# EAGLE design playpad_shield (EAGLE 5.10)

## Sheet 1 of 2
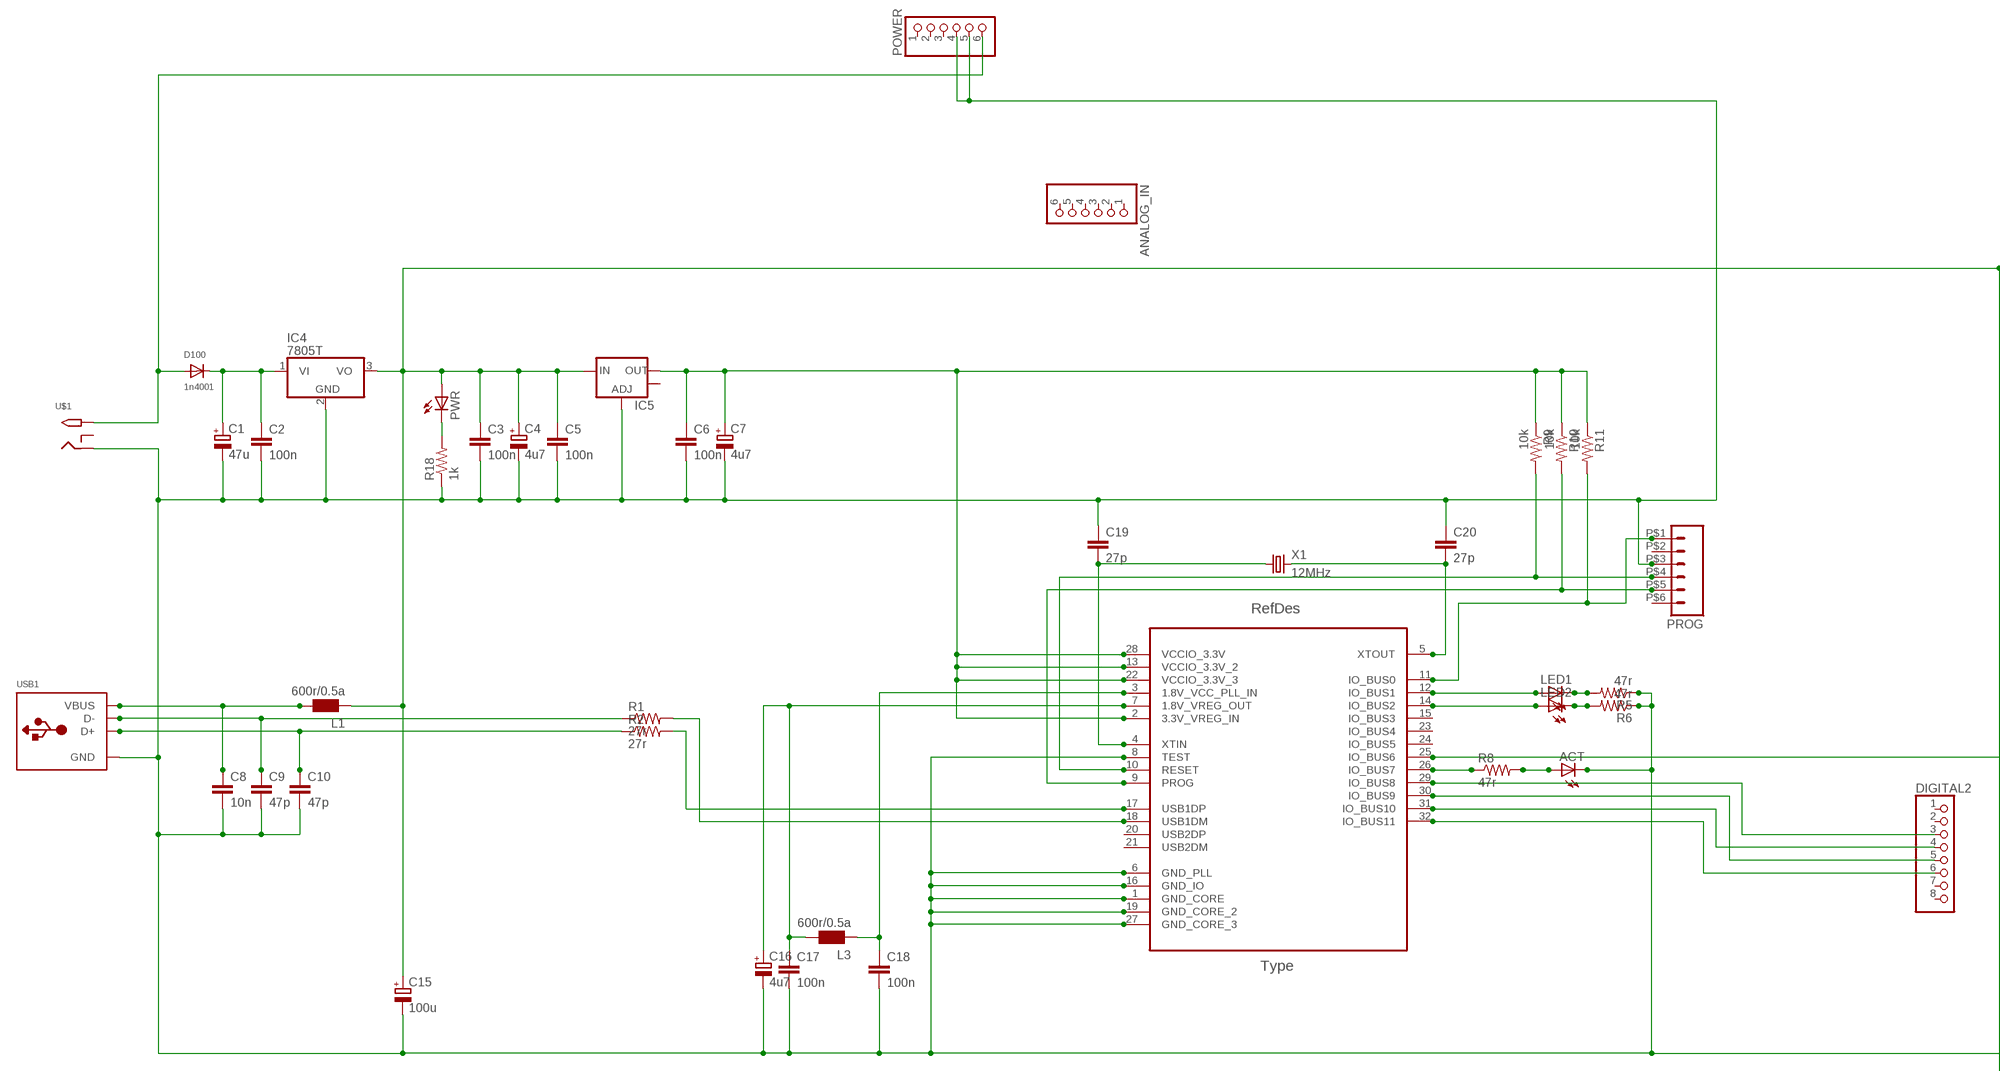
[diagram p0: schematic, sheet 1, part 1 of 2]
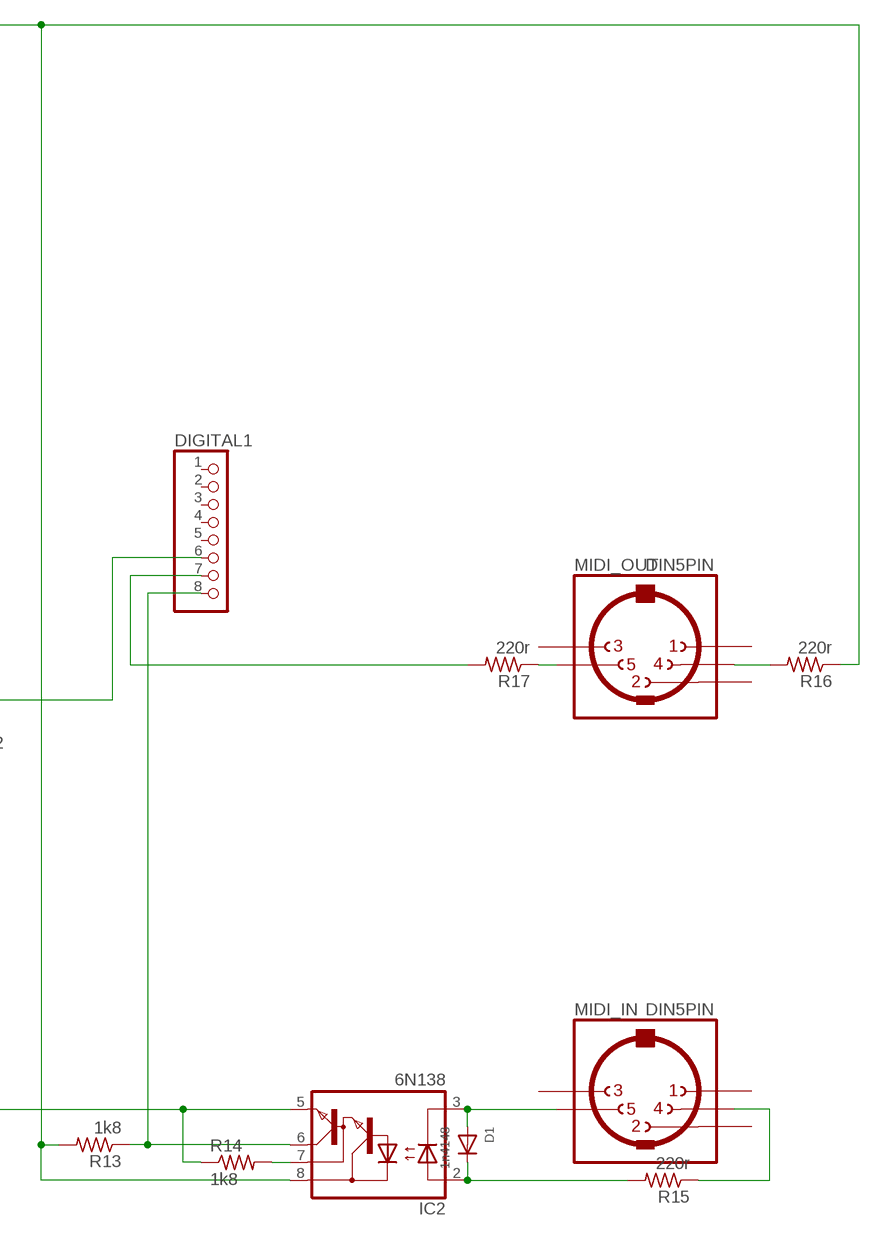
[diagram p1: schematic, sheet 1, part 2 of 2]

### Parts
ACT  LEDCHIP-LED0805  [CHIP-LED0805]
ANALOG_IN  PINHD-1X6  [1X06]
C1  47u  CPOL-EUA/3216-18W  [A/3216-18W]
C2  100n  C-EUC0805  [C0805]
C3  100n  C-EUC0805  [C0805]
C4  4u7  CPOL-EUA/3216-18W  [A/3216-18W]
C5  100n  C-EUC0805  [C0805]
C6  100n  C-EUC0805  [C0805]
C7  4u7  CPOL-EUA/3216-18W  [A/3216-18W]
C8  10n  C-EUC0805  [C0805]
C9  47p  C-EUC0805  [C0805]
C10  47p  C-EUC0805  [C0805]
C15  100u  CPOL-EUD/7343-31R  [D/7343-31R]
C16  4u7  CPOL-EUA/3216-18W  [A/3216-18W]
C17  100n  C-EUC0805  [C0805]
C18  100n  C-EUC0805  [C0805]
C19  27p  C-EUC0805  [C0805]
C20  27p  C-EUC0805  [C0805]
D1  1n4148  DIODESOD-123  [SOD-123]
D100  1n4001  DIODESOD-123  [SOD-123]
DIGITAL1  PINHD-1X8  [1X08]
DIGITAL2  PINHD-1X8  [1X08]
IC1  VNC2-32L1B  [QFP80P900X900X160-33N]
IC2  6N138  [DIL08]
IC4  7805T  [TO220H]
IC5  V_REG_LM1117SOT223  [SOT223]
L1  600r/0.5a  WE-CBF_0805  [0805]
L3  600r/0.5a  WE-CBF_0805  [0805]
LED1  LEDCHIP-LED0805  [CHIP-LED0805]
LED2  LEDCHIP-LED0805  [CHIP-LED0805]
MIDI_IN  DIN5PIN  [CHEAPYDIN]
MIDI_OUT  DIN5PIN  [CHEAPYDIN]
POWER  PINHD-1X6  [1X06]
PROG  M06  [MA062MM]
PWR  LEDCHIP-LED0805  [CHIP-LED0805]
R1  27r  R-US_R0805  [R0805]
R2  27r  R-US_R0805  [R0805]
R5  47r  R-US_R0805  [R0805]
R6  47r  R-US_R0805  [R0805]
R8  47r  R-US_R0805  [R0805]
R9  10k  R-US_R0805  [R0805]
R10  10k  R-US_R0805  [R0805]
R11  10k  R-US_R0805  [R0805]
R13  1k8  R-US_R0805  [R0805]
R14  1k8  R-US_R0805  [R0805]
R15  220r  R-US_R0805  [R0805]
R16  220r  R-US_R0805  [R0805]
R17  220r  R-US_R0805  [R0805]
R18  1k  R-US_R0805  [R0805]
U$1  2.1MMJACKTHM  [PJ-102A]
USB1  USB_TYPEAPTHFML  [USB_HOST-PTH]
X1  12MHz  CRYSTALHC49S  [HC49/S]

### Nets
3V3: C6.1 C7.+ IC1.2(3.3V_VREG_IN) IC1.13(VCCIO_3.3V_2) IC1.22(VCCIO_3.3V_3) IC1.28(VCCIO_3.3V) IC5.2(OUT) R9.1 R10.1 R11.1
5V: C3.1 C4.+ C5.1 C15.+ IC2.8(VCC) IC4.3(VO) IC5.3(IN) L1.1 PWR.A R13.2 R16.1
GND: ACT.C C1.- C2.2 C3.2 C4.- C5.2 C6.2 C7.- C8.2 C9.2 C10.2 C15.- C16.- C17.2 C18.2 C19.1 C20.1 IC1.1(GND_CORE) IC1.6(GND_PLL) IC1.8(TEST) IC1.16(GND_IO) IC1.19(GND_CORE_2) IC1.27(GND_CORE_3) IC2.5(GND) IC4.2(GND) IC5.1(ADJ) POWER.4 POWER.5 PROG.P$3 R5.1 R6.1 R14.1 R18.1 U$1.RING USB1.GND
MIDI_RX: DIGITAL1.8 IC2.6(VO) R13.1
MIDI_TX: DIGITAL1.7 R17.2
N$1: C18.1 IC1.3(1.8V_VCC_PLL_IN) L3.1
N$2: IC1.12(IO_BUS1) LED1.A
N$3: PWR.C R18.2
N$4: IC1.14(IO_BUS2) LED2.A
N$7: C1.+ C2.1 D100.C IC4.1(VI)
N$8: C8.1 L1.2 USB1.VBUS
N$9: LED1.C R5.2
N$10: LED2.C R6.2
N$14: C10.1 R2.1 USB1.D+
N$15: C9.1 R1.1 USB1.D-
N$17: IC1.26(IO_BUS7) R8.1
N$22: IC1.11(IO_BUS0) PROG.P$1 R11.2
N$23: MIDI_OUT.5 R17.1
N$26: D1.A IC2.3(C) MIDI_IN.5
N$31: ACT.A R8.2
N$33: D1.C IC2.2(A) R15.2
N$34: MIDI_IN.4 R15.1
N$36: IC2.7(VB) R14.2
N$42: C16.+ C17.1 IC1.7(1.8V_VREG_OUT) L3.2
N$55: MIDI_OUT.4 R16.2
PROG: IC1.9(PROG) PROG.P$5 R10.2
RESET: IC1.10(RESET) PROG.P$4 R9.2
SLAVE_INT: DIGITAL1.6 IC1.25(IO_BUS6)
SPI_SLAVE_CLK: DIGITAL2.3 IC1.29(IO_BUS8)
SPI_SLAVE_MISO: DIGITAL2.4 IC1.31(IO_BUS10)
SPI_SLAVE_MOSI: DIGITAL2.5 IC1.30(IO_BUS9)
SPI_SLAVE_SS: DIGITAL2.6 IC1.32(IO_BUS11)
USB1DM: IC1.18(USB1DM) R1.2
USB1DP: IC1.17(USB1DP) R2.2
VIN: D100.A POWER.6 U$1.TIP
XTIN: C19.2 IC1.4(XTIN) X1.1
XTOUT: C20.2 IC1.5(XTOUT) X1.2
Unconnected: ANALOG_IN.1 ANALOG_IN.2 ANALOG_IN.3 ANALOG_IN.4 ANALOG_IN.5 ANALOG_IN.6 DIGITAL1.1 DIGITAL1.2 DIGITAL1.3 DIGITAL1.4 DIGITAL1.5 DIGITAL2.1 DIGITAL2.2 DIGITAL2.7 DIGITAL2.8 IC1.15(IO_BUS3) IC1.20(USB2DP) IC1.21(USB2DM) IC1.23(IO_BUS4) IC1.24(IO_BUS5) IC5.4(OUT) MIDI_IN.1 MIDI_IN.2 MIDI_IN.3 MIDI_OUT.1 MIDI_OUT.2 MIDI_OUT.3 POWER.1 POWER.2 POWER.3 PROG.P$2 PROG.P$6 U$1.RING_SW

## Sheet 2 of 2
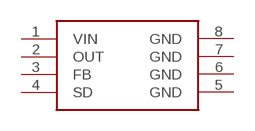
[diagram p2: schematic, sheet 2]

### Parts
U$2  AP1509_SW_REG  [SO08]
Unconnected: U$2.1(VIN) U$2.2(OUT) U$2.3(FB) U$2.4(SD)

## Power pins joined to a net without a drawn wire
GND: U$2.5(GND) U$2.6(GND) U$2.7(GND) U$2.8(GND)

## Library data of the parts
ACT LED1 LED2 PWR = led:LED: LED OSRAM: - CHIPLED LG R971, LG N971, LY N971, LG Q971, LY Q971, LO R971, LY R971 LH N974, LH R974 LS Q976, LO Q976, LY Q976 LO Q996 - Hyper CHIPLED LW Q18S LB Q993, LB Q99A, LB R99A - SideLED LS A670, LO A670, LY A670, LG A670, LP A670 LB A673, LV A673, LT A673, LW A673 LH A674 LY A675 LS A676, LA A676, LO A676, LY A676, LW A676 LS A679, LY A679, LG A679 - Hyper Micro SIDELED® LS Y876, LA Y876, LO Y876, LY Y876 LT Y87S - SmartLED LW L88C, LW L88S LB L89C, LB L89S, LG L890 LS L89K, LO L89K, LY L89K LS L896, LA L896, LO L896, LY L896 - TOPLED LS T670, LO T670, LY T670, LG T670, LP T670 LSG T670, LSP T670, LSY T670, LOP T670, LYG T670 LG T671, LOG T671, LSG T671 LB T673, LV T673, LT T673, LW T673 LH T674 LS T676, LA T676, LO T676, LY T676, LB T676, LH T676, LSB T676, LW T676 LB T67C, LV T67C, LT T67C, LS T67K, LO T67K, LY T67K, LW E67C LS E67B, LA E67B, LO E67B, LY E67B, LB E67C, LV E67C, LT E67C LW T67C LS T679, LY T679, LG T679 LS T770, LO T770, LY T770, LG T770, LP T770 LB T773, LV T773, LT T773, LW T773 LH T774 LS E675, LA E675, LY E675, LS T675 LS T776, LA T776, LO T776, LY T776, LB T776 LHGB T686 LT T68C, LB T68C - Hyper Mini TOPLED® LB M676 - Mini TOPLED Santana® LG M470 LS M47K, LO M47K, LY M47K Source: http://www.osram.convergy.de LUXEON: - LUMILED® LXK2-PW12-R00, LXK2-PW12-S00, LXK2-PW14-U00, LXK2-PW14-V00 LXK2-PM12-R00, LXK2-PM12-S00, LXK2-PM14-U00 LXK2-PE12-Q00, LXK2-PE12-R00, LXK2-PE12-S00, LXK2-PE14-T00, LXK2-PE14-U00 LXK2-PB12-K00, LXK2-PB12-L00, LXK2-PB12-M00, LXK2-PB14-N00, LXK2-PB14-P00, LXK2-PB14-Q00 LXK2-PR12-L00, LXK2-PR12-M00, LXK2-PR14-Q00, LXK2-PR14-R00 LXK2-PD12-Q00, LXK2-PD12-R00, LXK2-PD12-S00 LXK2-PH12-R00, LXK2-PH12-S00 LXK2-PL12-P00, LXK2-PL12-Q00, LXK2-PL12-R00 Source: www.luxeon.com KINGBRIGHT: KA-3528ASYC Source: www.kingbright.com
ANALOG_IN POWER = pinhead:PINHD-1X6: PIN HEADER
C1 C4 C7 C15 C16 = rcl:CPOL-EU: POLARIZED CAPACITOR, European symbol
C2 C3 C5 C6 C8-C10 C17-C20 = rcl:C-EU: CAPACITOR, European symbol
D1 D100 = adafruit:DIODE: Diode SMADIODE - SMA Surface Mount Package 20V 1A Schottky Diode Digikey: 641-1014-6-ND DO-1N4148 - Through Hole Small Current Diode SOD-123 20V 1 A (.5mV Vf) Schottky Diode - Digikey: MBRX120TPMSCT-ND SOD-323 10V 570mA (.38mV Vf, 3ns) Schottky Diode - Digikey: ZLLS410CT-ND SOD-523 30V 30mA Schottky Diode (RB751S-40TE61) - Digikey: RB751S-40TE61CT-ND SOT23-R/W - SOT23 Package (R = Solder Paste/Reflow Ovens, W = Hand-Soldering) BAT54Film 40V 300mA - Digikey: 497-7162-1-ND
DIGITAL1 DIGITAL2 = pinhead:PINHD-1X8: PIN HEADER
IC1 = farnell_downloads:VNC2-32L1B: Embedded Dual USB Host Controller; DESCRIPTION: Embedded Dual USB Host Controller; MPN: VNC2-32L1B; OC_FARNELL: 1863854; OC_NEWARK: 27T5918; PACKAGE: QFP-32; SUPPLIER: FTDI
IC2 = optocoupler:6N138: MOTOROLA OPTO COUPLER
IC4 = linear:78*: Positive VOLTAGE REGULATOR Source: http://cache.national.com/ds/LM/LM78L05.pdf http://www.fairchildsemi.com/ds/LM/LM7805.pdf
IC5 = SparkFun:V_REG_LM1117: Voltage Regulator LM1117 Standard adjustable voltage regulator but in SMD form. Spark Fun Electronics SKU : COM-00595
L1 L3 = wuerth-elektronik:WE-CBF: SMD EMI Suppression Ferrite Beads - excellent anti-EMI properties - low DCR - impedances till 3000 ohms - rated current up to 6 A
MIDI_IN MIDI_OUT = jasons_stuff:DIN5PIN: Female CONNECTOR 5 pins 90 deg. with shield, horizontal (DIN 41524)
PROG = jasons_stuff:M06: Header 6 Standard 6-pin 0.1" header. Use with straight break away headers (SKU : PRT-00116), right angle break away headers (PRT-00553), swiss pins (PRT-00743), machine pins (PRT-00117), and female headers (PRT-00115). Molex polarized connector foot print use with SKU : PRT-08094 with associated crimp pins and housings. NOTES ON THE VARIANTS LOCK and LOCK_LONGPADS... This footprint was designed to help hold the alignment of a through-hole component (i.e. 6-pin header) while soldering it into place. You may notice that each hole has been shifted either up or down by 0.005 of an inch from it's more standard position (which is a perfectly straight line). This slight alteration caused the pins (the squares in the middle) to touch the edges of the holes. Because they are alternating, it causes a "brace" to hold the component in place. 0.005 has proven to be the perfect amount of "off-center" position when using our standard breakaway headers. Although looks a little odd when you look at the bare footprint, once you have a header in there, the alteration is very hard to notice. Also, if you push a header all the way into place, it is covered up entirely on the bottom side. This idea of altering the position of holes to aid alignment will be further integrated into the Sparkfun Library for other footprints. It can help hold any component with 3 or more connection pins.
R1 R2 R5 R6 R8-R11 R13-R18 = adafruit:R-US_: RESISTOR, American symbol
U$1 = adafruit:2.1MMJACK: 2.1mm x 5.5mm THM DC jack with internal switch. Digikey part #PJ-102A, 4UCON part #05537 2.1mm x 5.5mm SMT DC jack with internal switch. Digikey part #PJ-002A-SMT, 4UCON part #03267 By microbuilder.eu & adafruit.com
U$2 = jasons_stuff:AP1509_SW_REG
USB1 = microbuilder:USB_TYPEA: USB - Type A Connectors SMT Male - 4UCON: 10017 PTH Female - ???
X1 = crystal:CRYSTAL: CRYSTAL

## Board
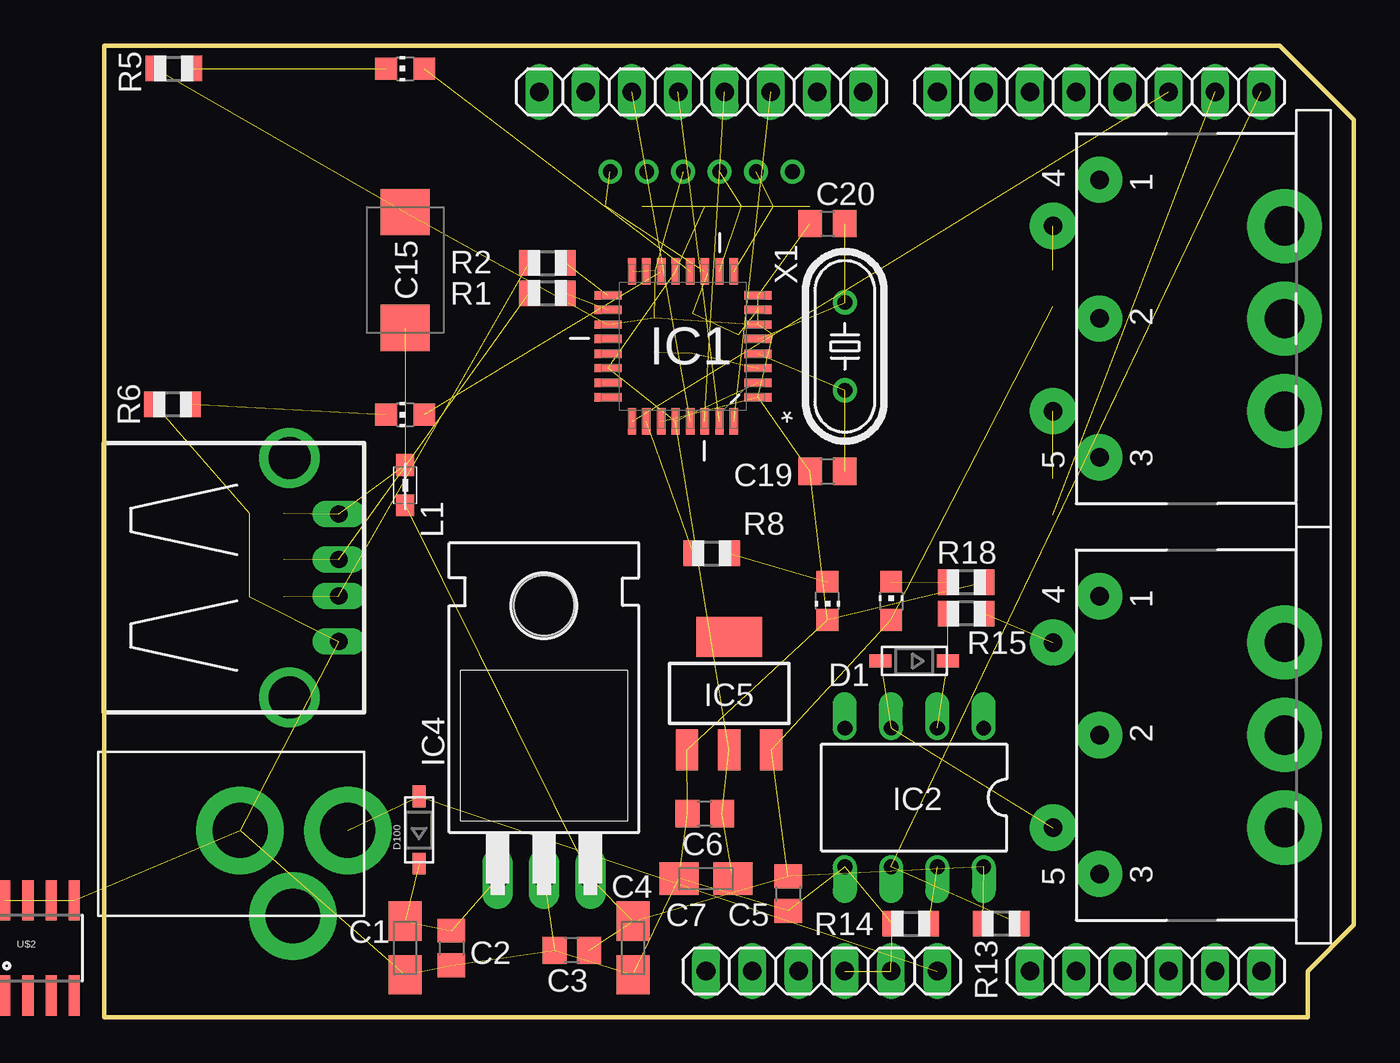
[diagram p3: board, top side]
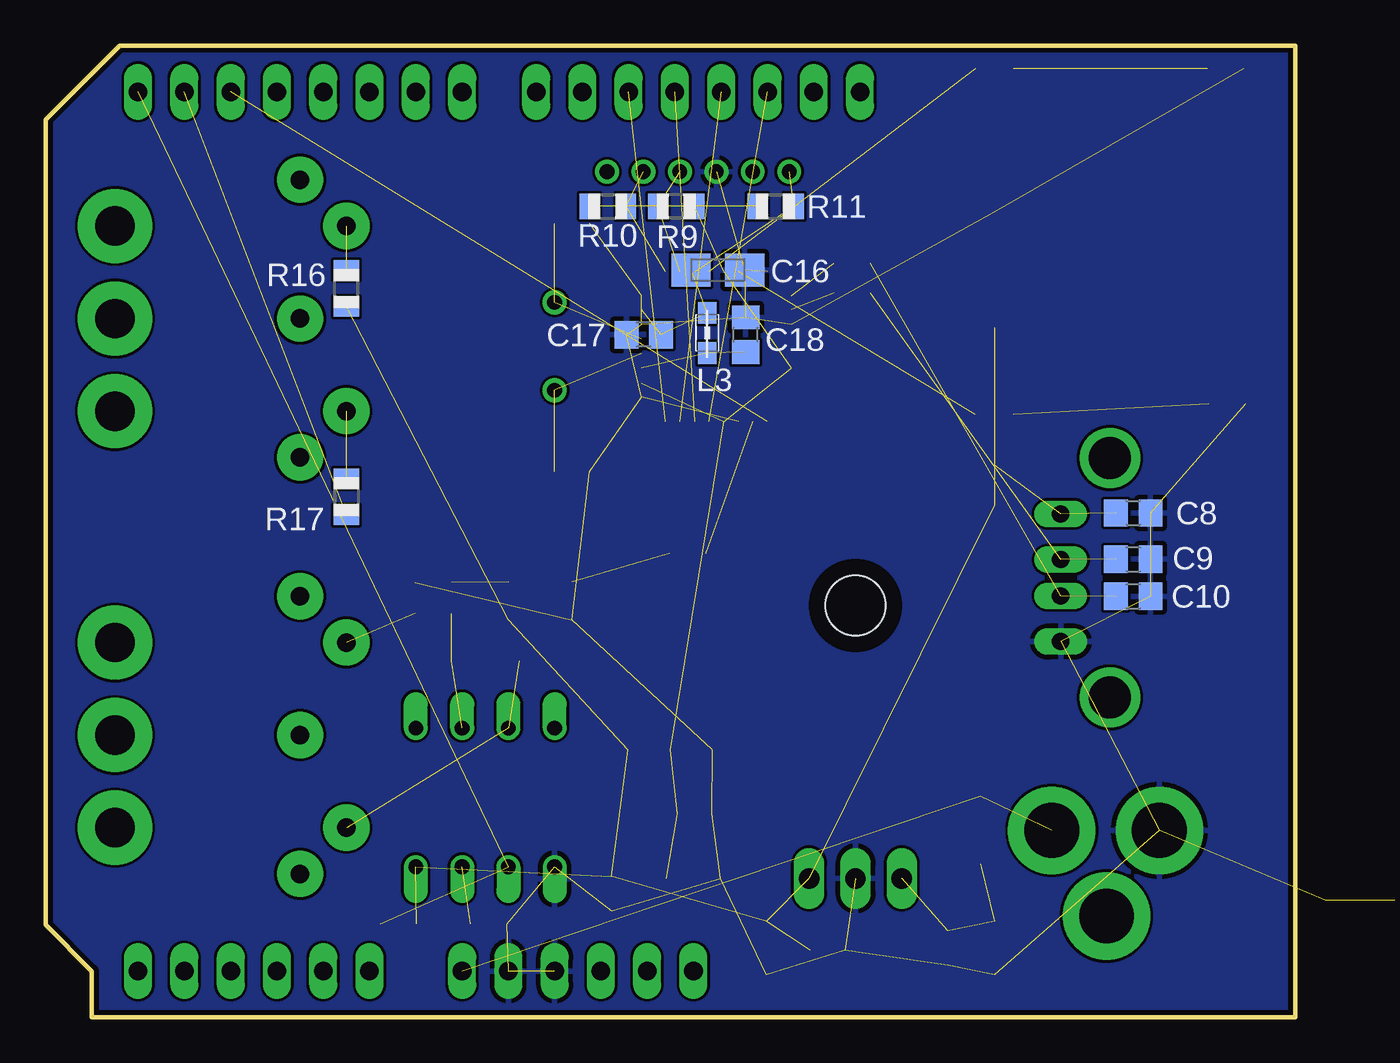
[diagram p4: board, bottom side, seen from below]

Size 68.58 x 53.34 mm. Coordinates in mm from the lower left corner, seen from the top.
Outline: 0,0 66.04,0 66.04,2.54 68.58,5.08 68.58,49.28 64.52,53.34 0,53.34 0,0
Copper layers (1*16): Top 0.035mm / dielectric 1.5mm / Bottom 0.035mm
Design rules "ITEADstudio_DRC": minimum track width 6mil, minimum drill 12mil, track to track 6mil, track to pad 6mil, pad to pad 6mil, via to via 6mil, smd to smd 0mil, copper to edge 10mil, drill to drill 10mil, minimum pad ring 10mil, minimum via ring 6mil, stop-mask expansion 2mil, vias tented up to drill 100mil, thermal gap 10mil

### Footprints (pad centres in the part's own frame; a part is rotated, then mirrored left to right if it is on the bottom)
CHIP-LED0805 = smd 1.2 x 1.2: A 0,-1.05; C 0,1.05
1X06 = drill 1.016 long: 1 -6.35,0; 2 -3.81,0; 3 -1.27,0; 4 1.27,0; 5 3.81,0; 6 6.35,0
A/3216-18W = smd 2.15 x 1.8: + 1.475,0; - -1.475,0
C0805 = smd 1.3 x 1.5: 1 -0.95,0; 2 0.95,0
D/7343-31R = smd 2.55 x 2.7: + 3.175,0; - -3.175,0
SOD-123 = smd 1.2 x 0.7: A 1.85,0; C -1.85,0
1X08 = drill 1.016 long: 1 -8.89,0; 2 -6.35,0; 3 -3.81,0; 4 -1.27,0; 5 1.27,0; 6 3.81,0; 7 6.35,0; 8 8.89,0
QFP80P900X900X160-33N = smd 1.473 x 0.457: 1 -4.115,2.794; 2 -4.115,2.007; 3 -4.115,1.194; 4 -4.115,0.406; 5 -4.115,-0.406; 6 -4.115,-1.194; 7 -4.115,-2.007; 8 -4.115,-2.794; 17 4.115,-2.794; 18 4.115,-2.007; 19 4.115,-1.194; 20 4.115,-0.406; 21 4.115,0.406; 22 4.115,1.194; 23 4.115,2.007; 24 4.115,2.794 | smd 0.457 x 1.473: 9 -2.794,-4.115; 10 -2.007,-4.115; 11 -1.194,-4.115; 12 -0.406,-4.115; 13 0.406,-4.115; 14 1.194,-4.115; 15 2.007,-4.115; 16 2.794,-4.115; 25 2.794,4.115; 26 2.007,4.115; 27 1.194,4.115; 28 0.406,4.115; 29 -0.406,4.115; 30 -1.194,4.115; 31 -2.007,4.115; 32 -2.794,4.115
DIL08 = drill 0.813 offset: 1 -3.81,-3.81; 2 -1.27,-3.81; 3 1.27,-3.81; 4 3.81,-3.81; 5 3.81,3.81; 6 1.27,3.81; 7 -1.27,3.81; 8 -3.81,3.81
TO220H = drill 1.118 long: 1 -2.54,-10.16; 2 0,-10.16; 3 2.54,-10.16 | hole 3.302: 0,4.826
SOT223 = smd 1.219 x 2.235: 1 -2.311,-3.099; 2 0,-3.099; 3 2.311,-3.099 | smd 3.6 x 2.2: 4 0,3.099
0805 = smd 1.2 x 1: 1 -1.1,0; 2 1.1,0
CHEAPYDIN = drill 1.016 pad 2.54 round: 1 7.62,5.08; 2 0,5.08; 3 -7.62,5.08; 4 5.08,7.62; 5 -5.08,7.62 | drill 2.159 pad 4.064 round: NC -5.08,-5.08; NC1 0,-5.08; NC2 5.08,-5.08
MA062MM = drill 0.8 round: P$1 -5,0; P$2 -3,0; P$3 -1,0; P$4 1,0; P$5 3,0; P$6 5,0
R0805 = smd 1.1 x 1.4: 1 -1,0; 2 1,0
PJ-102A = drill 3 pad 4.8 round: RING 0.1,-3.39; RING_SW -4.6,-6.29; TIP 0.1,-9.29
SO08 = smd 0.61 x 2.21: 1 -1.905,-2.616; 2 -0.635,-2.616; 3 0.635,-2.616; 4 1.905,-2.616; 5 1.905,2.616; 6 0.635,2.616; 7 -0.635,2.616; 8 -1.905,2.616
USB_HOST-PTH = drill 0.95 long: D+ 1,6.52; D- -1,6.52; GND 3.5,6.52; VBUS -3.5,6.52 | drill 2.3 pad 2.9 round: S1 -6.57,3.81; S2 6.57,3.81
HC49/S = drill 0.813 round: 1 -2.413,0; 2 2.413,0

### Placement (x,y rotation side)
ACT  39.69,22.86 180 top
ANALOG_IN  57.15,2.54 0 top
C1  16.51,3.81 90 top
C2  19.05,3.81 270 top
C3  25.65,3.68 180 top
C4  29.02,3.81 90 top
C5  37.53,6.79 270 top
C6  32.96,11.18 180 top
C7  33.02,7.62 0 top
C8  8.89,27.69 0 bottom
C9  8.89,25.15 0 bottom
C10  8.89,23.11 0 bottom
C15  16.51,41.02 270 top
C16  31.69,41.02 180 bottom
C17  35.75,37.47 180 bottom
C18  30.16,37.47 90 bottom
C19  39.69,29.97 0 top
C20  39.69,43.56 0 top
D1  44.45,19.56 180 top
D100  17.27,10.29 90 top
DIGITAL1  54.61,50.8 0 top
DIGITAL2  32.77,50.8 0 top
IC1  31.75,36.83 180 top
IC2  44.45,12.06 180 top
IC4  24.13,17.78 0 top
IC5  34.29,17.78 0 top
L1  16.51,29.21 90 top
L3  32.27,37.57 90 bottom
LED1  16.51,52.07 90 top
LED2  16.51,33.08 90 top
MIDI_IN  59.69,15.49 90 top
MIDI_OUT  59.69,38.35 90 top
POWER  39.37,2.54 0 top
PROG  32.77,46.42 0 top
PWR  43.18,22.86 0 top
R1  24.32,39.75 0 top
R2  24.32,41.4 0 top
R5  3.81,52.07 0 top
R6  3.75,33.66 0 top
R8  33.34,25.46 0 top
R9  33.97,44.51 180 bottom
R10  37.72,44.51 0 bottom
R11  28.51,44.51 0 bottom
R13  49.21,5.14 180 top
R14  44.26,5.14 0 top
R15  47.31,22.16 180 top
R16  52.07,40.01 90 bottom
R17  52.07,28.57 270 bottom
R18  47.31,23.88 180 top
U$1  4.06,10.16 90 top
U$2  -3.56,3.81 0 top
USB1  6.35,24.13 270 top
X1  40.64,36.83 90 top

### Tracks (layer width: path | path; a pad name or v marks a point on that pad's centre or on a via)
3V3  (9 unrouted)
5V  (10 unrouted)
GND  (38 unrouted)
  pour Bottom: 0,53.34 0,0 66.04,0 66.04,2.54 68.58,5.08 68.58,49.28 64.52,53.34
MIDI_RX  (2 unrouted)
MIDI_TX  (1 unrouted)
N$1  (2 unrouted)
N$2  (1 unrouted)
N$3  (1 unrouted)
N$4  (1 unrouted)
N$7  (3 unrouted)
N$8  (2 unrouted)
N$9  (1 unrouted)
N$10  (1 unrouted)
N$14  (2 unrouted)
N$15  (2 unrouted)
N$17  (1 unrouted)
N$22  (2 unrouted)
N$23  (1 unrouted)
N$26  (2 unrouted)
N$31  (1 unrouted)
N$33  (2 unrouted)
N$34  (1 unrouted)
N$36  (1 unrouted)
N$42  (3 unrouted)
N$55  (1 unrouted)
PROG  (2 unrouted)
RESET  (2 unrouted)
SLAVE_INT  (1 unrouted)
SPI_SLAVE_CLK  (1 unrouted)
SPI_SLAVE_MISO  (1 unrouted)
SPI_SLAVE_MOSI  (1 unrouted)
SPI_SLAVE_SS  (1 unrouted)
USB1DM  (1 unrouted)
USB1DP  (1 unrouted)
VIN  (2 unrouted)
XTIN  (2 unrouted)
XTOUT  (2 unrouted)

### Text on the board
tDocu: VNC2 | DEBUG
bDocu: dual USB host to | midi shield rev 1